# EAGLE schematic HTVC8038 (EAGLE 7.4.0)
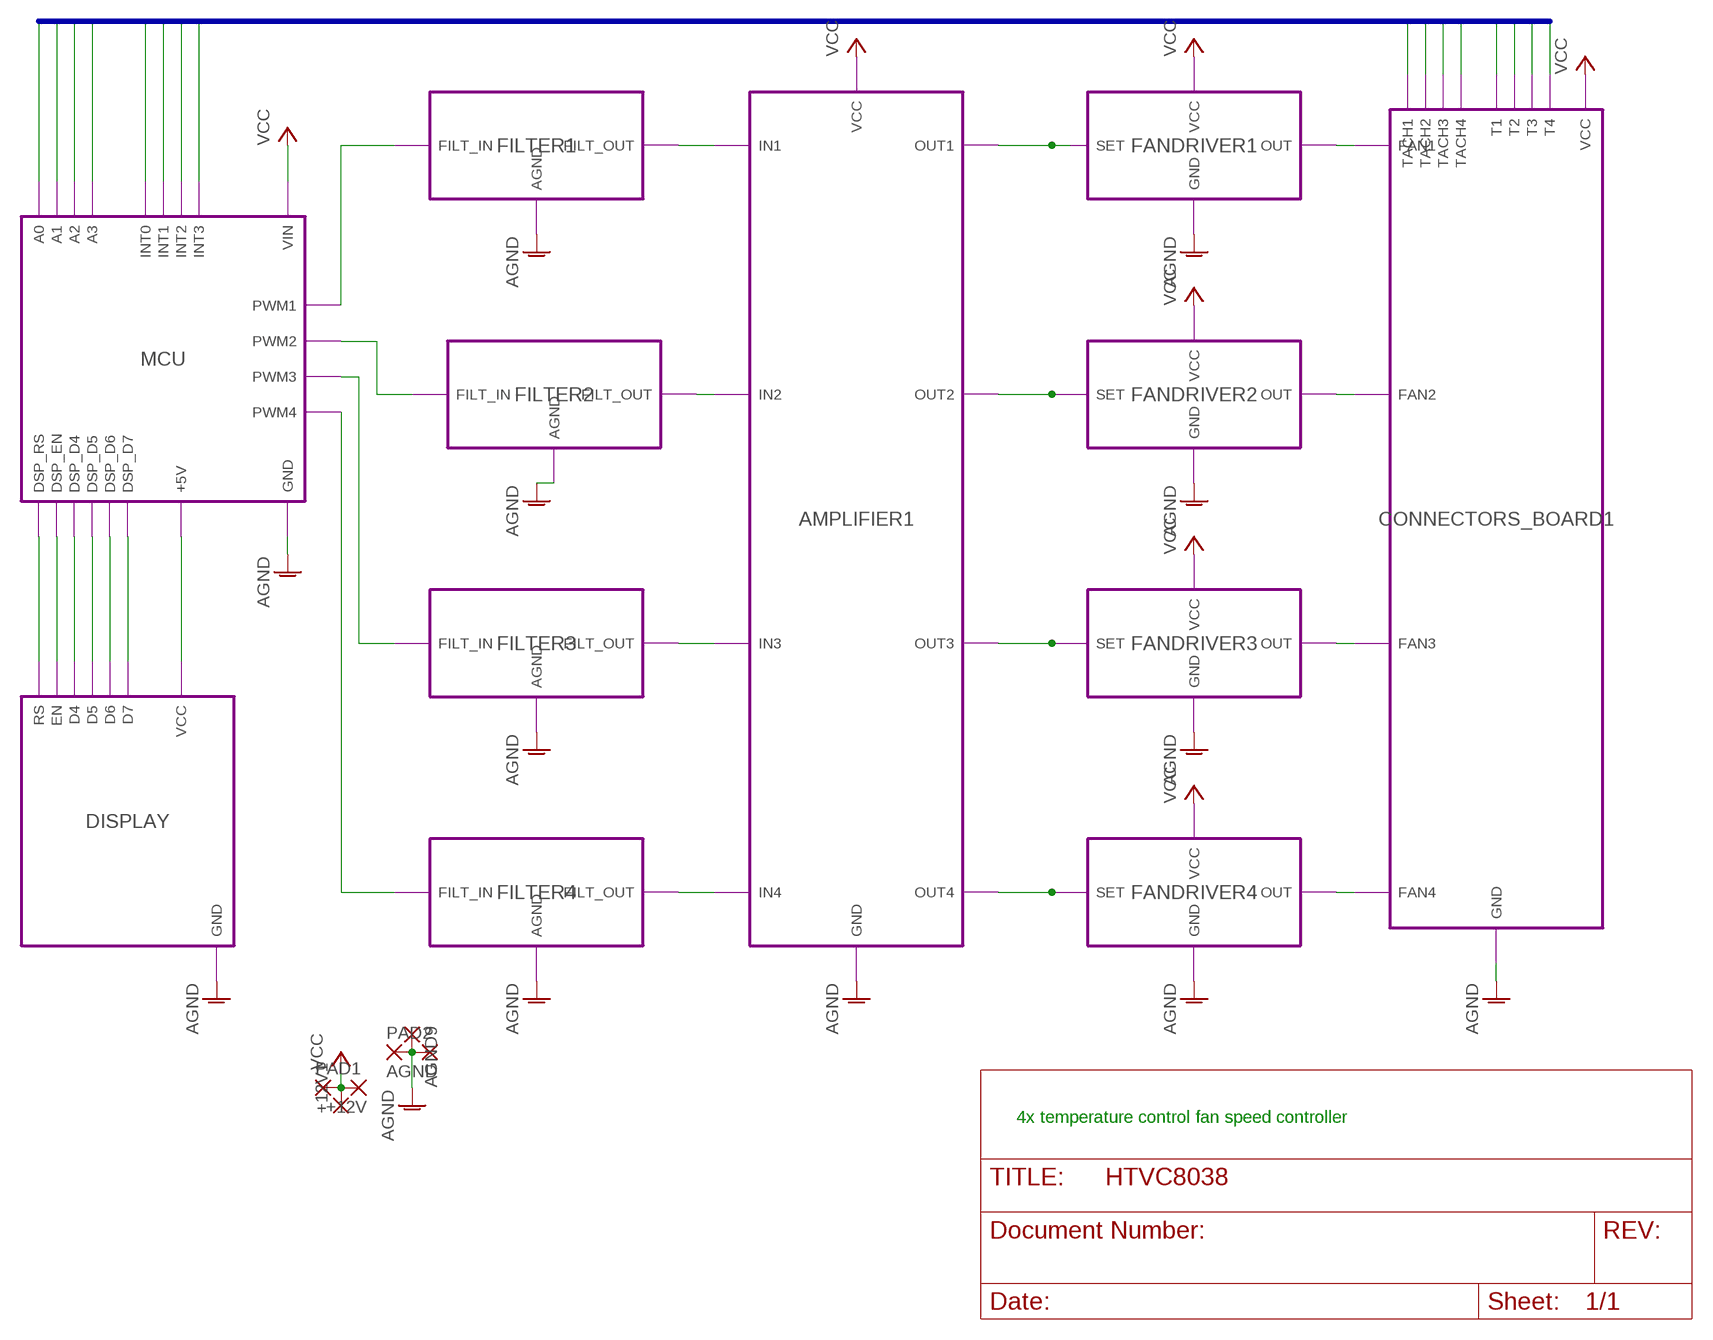
[diagram p0: schematic, sheet 1]

## Parts
+12V  3,17/1,3  [3,17/1,3]
+12V1  3,17/1,3  [3,17/1,3]
AGND  3,17/1,3  [3,17/1,3]
AGND9  3,17/1,3  [3,17/1,3]
PAD1  3,17/1,3  [3,17/1,3]
PAD2  3,17/1,3  [3,17/1,3]

## Module instances
FILTER1 = FILTER
FILTER2 = FILTER
FILTER3 = FILTER
FILTER4 = FILTER
MCU = MCU
CONNECTORS_BOARD1 = CONNECTORS_BOARD
DISPLAY = DISPLAY_BOARD
AMPLIFIER1 = AMPLIFIER
FANDRIVER1 = FANDRIVER
FANDRIVER2 = FANDRIVER
FANDRIVER3 = FANDRIVER
FANDRIVER4 = FANDRIVER

## Nets
+5V [+5V]: port MCU.+5V DISPLAY.VCC
A0: port MCU.A0 CONNECTORS_BOARD1.T1
A1: port MCU.A1 CONNECTORS_BOARD1.T2
A2: port MCU.A2 CONNECTORS_BOARD1.T3
A3: port MCU.A3 CONNECTORS_BOARD1.T4
AGND [AGND]: AGND9.1(P) AGND.1(P) PAD2.1(P) ; port FILTER1.AGND FILTER2.AGND FILTER3.AGND FILTER4.AGND AMPLIFIER1.GND FANDRIVER1.GND FANDRIVER2.GND FANDRIVER3.GND FANDRIVER4.GND DISPLAY.GND MCU.GND CONNECTORS_BOARD1.GND
N$1: port MCU.DSP_RS DISPLAY.RS
N$2: port MCU.DSP_EN DISPLAY.EN
N$3: port MCU.DSP_D4 DISPLAY.D4
N$4: port MCU.DSP_D5 DISPLAY.D5
N$5: port MCU.DSP_D6 DISPLAY.D6
N$6: port MCU.DSP_D7 DISPLAY.D7
N$9: port FANDRIVER4.OUT CONNECTORS_BOARD1.FAN4
N$10: port FANDRIVER3.OUT CONNECTORS_BOARD1.FAN3
N$11: port FANDRIVER2.OUT CONNECTORS_BOARD1.FAN2
N$12: port FANDRIVER1.OUT CONNECTORS_BOARD1.FAN1
N$21: port MCU.PWM1 FILTER1.FILT_IN
N$22: port MCU.PWM2 FILTER2.FILT_IN
N$23: port MCU.PWM3 FILTER3.FILT_IN
N$37: port MCU.PWM4 FILTER4.FILT_IN
N$45: port FILTER1.FILT_OUT AMPLIFIER1.IN1
N$46: port FILTER2.FILT_OUT AMPLIFIER1.IN2
N$47: port FILTER3.FILT_OUT AMPLIFIER1.IN3
N$48: port FILTER4.FILT_OUT AMPLIFIER1.IN4
N$49: port FANDRIVER1.SET AMPLIFIER1.OUT1
N$50: port AMPLIFIER1.OUT2 FANDRIVER2.SET
N$51: port AMPLIFIER1.OUT3 FANDRIVER3.SET
N$52: port AMPLIFIER1.OUT4 FANDRIVER4.SET
TACH0: port MCU.INT0 CONNECTORS_BOARD1.TACH1
TACH1: port MCU.INT1 CONNECTORS_BOARD1.TACH2
TACH2: port MCU.INT2 CONNECTORS_BOARD1.TACH3
TACH3: port MCU.INT3 CONNECTORS_BOARD1.TACH4
VCC [VCC]: +12V1.1(P) +12V.1(P) PAD1.1(P) ; port AMPLIFIER1.VCC FANDRIVER1.VCC FANDRIVER2.VCC FANDRIVER3.VCC FANDRIVER4.VCC CONNECTORS_BOARD1.VCC MCU.VIN

## Buses
A[0..3],TACH[0..3]

## Notes on the sheet
- 4x temperature control fan speed controller

## Library data of the parts
+12V +12V1 AGND AGND9 PAD1 PAD2 = wirepad:3,17/1,3: THROUGH-HOLE PAD

## Module DISPLAY_BOARD
Ports: VCC(pwr) GND(pwr) RS(io) EN(io) D4(io) D5(io) D6(io) D7(io)
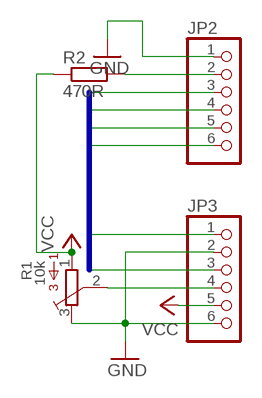
[diagram p1: schematic, module DISPLAY_BOARD, sheet 1]

### Parts
JP2  PINHD-1X6  [1X06]
JP3  PINHD-1X6  [1X06]
R1  10k  3362P  [3362P]
R2  470R  R-EU_0204/7  [0204/7]

### Nets
D4: JP2.6
D5: JP2.5
D6: JP2.4
D7: JP2.3
EN: JP3.1
GND: JP2.1 JP3.2 JP3.6 R1.3
N$1: JP3.4 R1.2
N$2: JP2.2 R2.2
RS: JP3.3
VCC: JP3.5 R1.1 R2.1

### Buses
D[4..7],BACKLIGHT,RS,EN

### Library data of the parts
JP2 JP3 = pinhead:PINHD-1X6: PIN HEADER
R1 = nervus:3362: 3362 Series 1/4" Square Trimmer
R2 = rcl:R-EU_: RESISTOR, European symbol

## Module CONNECTORS_BOARD
Ports: FAN1(io) FAN2(io) FAN3(io) FAN4(io) GND(io) TACH1(io) TACH2(io) TACH3(io) TACH4(io) T1(io) T2(io) T3(io) T4(io) VCC(pwr)
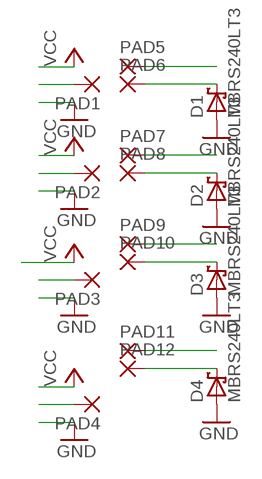
[diagram p2: schematic, module CONNECTORS_BOARD, sheet 1]

### Parts
D1  MBRS240LT3  [SMB-403A]
D2  MBRS240LT3  [SMB-403A]
D3  MBRS240LT3  [SMB-403A]
D4  MBRS240LT3  [SMB-403A]
PAD1  2,15/1,0  [2,15/1,0]
PAD2  2,15/1,0  [2,15/1,0]
PAD3  2,15/1,0  [2,15/1,0]
PAD4  2,15/1,0  [2,15/1,0]
PAD5  2,15/1,0  [2,15/1,0]
PAD6  2,15/1,0  [2,15/1,0]
PAD7  2,15/1,0  [2,15/1,0]
PAD8  2,15/1,0  [2,15/1,0]
PAD9  2,15/1,0  [2,15/1,0]
PAD10  2,15/1,0  [2,15/1,0]
PAD11  2,15/1,0  [2,15/1,0]
PAD12  2,15/1,0  [2,15/1,0]

### Nets
FAN1 [VCC]: D1.C PAD6.1(P)
FAN2 [VCC]: D2.C PAD8.1(P)
FAN3 [VCC]: D3.C PAD10.1(P)
FAN4 [VCC]: D4.C PAD12.1(P)
GND: D1.A D2.A D3.A D4.A
T1: PAD1.1(P)
T2: PAD2.1(P)
T3: PAD3.1(P)
T4: PAD4.1(P)
TACH1: PAD5.1(P)
TACH2: PAD7.1(P)
TACH3: PAD9.1(P)
TACH4: PAD11.1(P)

### Library data of the parts
D1-D4 = nervus:MBRS240LT3: Schottky Power Rectifier Source: http://www.onsemi.com/pub/Collateral/MBRS240LT3-D.PDF
PAD1-PAD12 = wirepad:2,15/1,0: THROUGH-HOLE PAD

## Module MCU
Ports: PWM1(out) PWM2(out) PWM3(out) PWM4(out) +5V(pwr) VIN(pwr) DSP_RS(io) DSP_EN(io) DSP_D4(io) DSP_D5(io) DSP_D6(io) DSP_D7(io) GND(pwr) A0(io) A1(io) A2(io) A3(io) INT0(io) INT1(io) INT2(io) INT3(io)
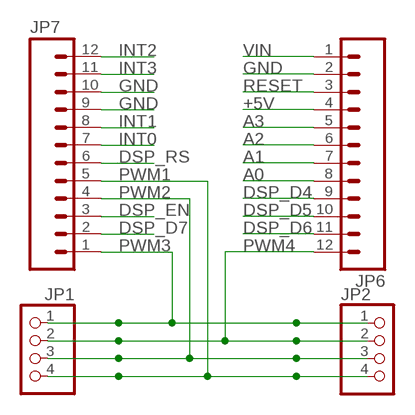
[diagram p3: schematic, module MCU, sheet 1]

### Parts
JP1  PINHD-1X4  [1X04]
JP2  PINHD-1X4  [1X04]
JP6  M12PTH  [1X12]
JP7  M12PTH  [1X12]

### Nets
+5V: JP6.4
A0: JP6.8
A1: JP6.7
A2: JP6.6
A3: JP6.5
DSP_D4: JP6.9
DSP_D5: JP6.10
DSP_D6: JP6.11
DSP_D7: JP7.2
DSP_EN: JP7.3
DSP_RS: JP7.6
GND: JP6.2 JP7.9 JP7.10
INT0: JP7.7
INT1: JP7.8
INT2: JP7.12
INT3: JP7.11
PWM1: JP1.4 JP2.4 JP7.5
PWM2: JP1.3 JP2.3 JP7.4
PWM3: JP1.1 JP2.1 JP7.1
PWM4: JP1.2 JP2.2 JP6.12
RESET: JP6.3
VIN [VCC]: JP6.1

### Library data of the parts
JP1 JP2 = pinhead:PINHD-1X4: PIN HEADER
JP6 JP7 = SparkFun:M12: Header 12 Standard 12-pin 0.1" header. Use with straight break away headers (SKU : PRT-00116), right angle break away headers (PRT-00553), swiss pins (PRT-00743), machine pins (PRT-00117), and female headers (PRT-00115).

## Module FILTER
Ports: FILT_IN(in) FILT_OUT(out) AGND(pwr)
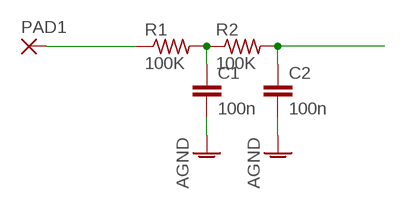
[diagram p4: schematic, module FILTER, sheet 1]

### Parts
C1  100n  C-EUC0805  [C0805]
C2  100n  C-EUC0805  [C0805]
PAD1  2,15/1,0  [2,15/1,0]
R1  100K  R-US_R0805  [R0805]
R2  100K  R-US_R0805  [R0805]

### Nets
AGND: C1.2 C2.2
FILT_IN: PAD1.1(P) R1.1
FILT_OUT: C2.1 R2.2
N$8: C1.1 R1.2 R2.1

### Library data of the parts
C1 C2 = resistor:C-EU: CAPACITOR, European symbol
PAD1 = wirepad:2,15/1,0: THROUGH-HOLE PAD
R1 R2 = resistor:R-US_: RESISTOR, American symbol

## Module FANDRIVER
Ports: SET(in) OUT(out) VCC(pwr) GND(pwr)
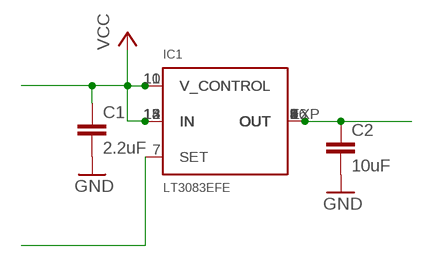
[diagram p5: schematic, module FANDRIVER, sheet 1]

### Parts
C1  2.2uF  C-EUC0805  [C0805]
C2  10uF  C-EUC1206  [C1206]
IC1  LT3083EFE  [TSSOP16EXP]

### Nets
GND: C1.2 C2.2
OUT: C2.1 IC1.1(OUT) IC1.2(OUT) IC1.3(OUT) IC1.4(OUT) IC1.5(OUT) IC1.6(OUT) IC1.8(OUT) IC1.9(OUT) IC1.16(OUT) IC1.EXP(OUT)
SET: IC1.7(SET)
VCC [VCC]: C1.1 IC1.10(V_CONTROL) IC1.11(V_CONTROL) IC1.12(IN) IC1.13(IN) IC1.14(IN) IC1.15(IN)

### Library data of the parts
C1 C2 = rcl:C-EU: CAPACITOR, European symbol
IC1 = nervus:LT3083

## Module AMPLIFIER
Ports: IN1(in) IN2(in) IN3(in) IN4(in) GND(pwr) VCC(pwr) OUT1(out) OUT2(out) OUT3(out) OUT4(out)
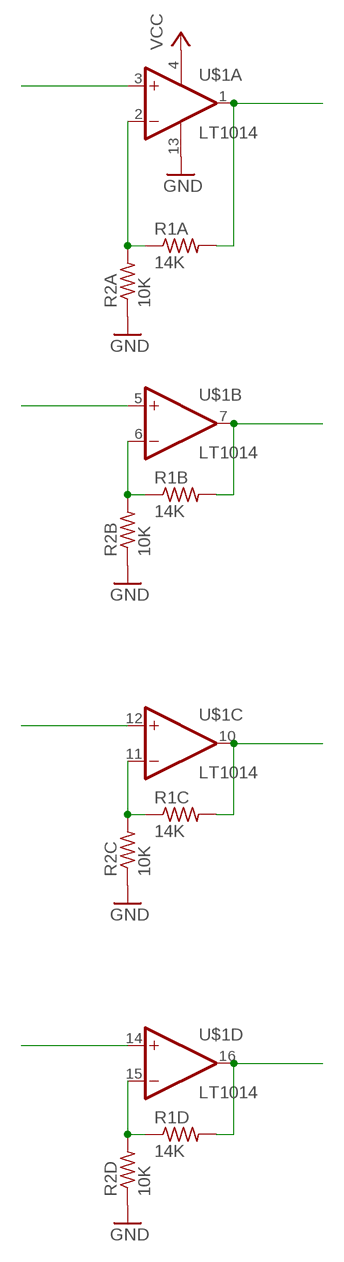
[diagram p6: schematic, module AMPLIFIER, sheet 1]

### Parts
R1A  14K  R-US_R0603  [R0603]
R1B  14K  R-US_R0603  [R0603]
R1C  14K  R-US_R0603  [R0603]
R1D  14K  R-US_R0603  [R0603]
R2A  10K  R-US_R0805  [R0805]
R2B  10K  R-US_R0805  [R0805]
R2C  10K  R-US_R0805  [R0805]
R2D  10K  R-US_R0805  [R0805]
U$1  LT1014  [SO16]

### Nets
GND: R2A.1 R2B.1 R2C.1 R2D.1 U$1.13(P:V-)
IN1: U$1.3(A:+IN)
IN2: U$1.5(B:+IN)
IN3: U$1.12(C:+IN)
IN4: U$1.14(D:+IN)
N$1: R1B.1 R2B.2 U$1.6(B:-IN)
N$2: R1C.1 R2C.2 U$1.11(C:-IN)
N$3: R1D.1 R2D.2 U$1.15(D:-IN)
N$9: R1A.1 R2A.2 U$1.2(A:-IN)
OUT1: R1A.2 U$1.1(A:OUT)
OUT2: R1B.2 U$1.7(B:OUT)
OUT3: R1C.2 U$1.10(C:OUT)
OUT4: R1D.2 U$1.16(D:OUT)
VCC: U$1.4(P:V+)

### Library data of the parts
R1A R1B R1C R1D = rcl:R-US_: RESISTOR, American symbol
R2A R2B R2C R2D = resistor:R-US_: RESISTOR, American symbol
U$1 = nervus:LT1014: Quad Precision Op AmpDatasheet <http://cds.linear.com/docs/en/datasheet/10134fd.pdf>